# EAGLE board EEZ PSU power board r5B9 (EAGLE 6.1), part 1 of 2
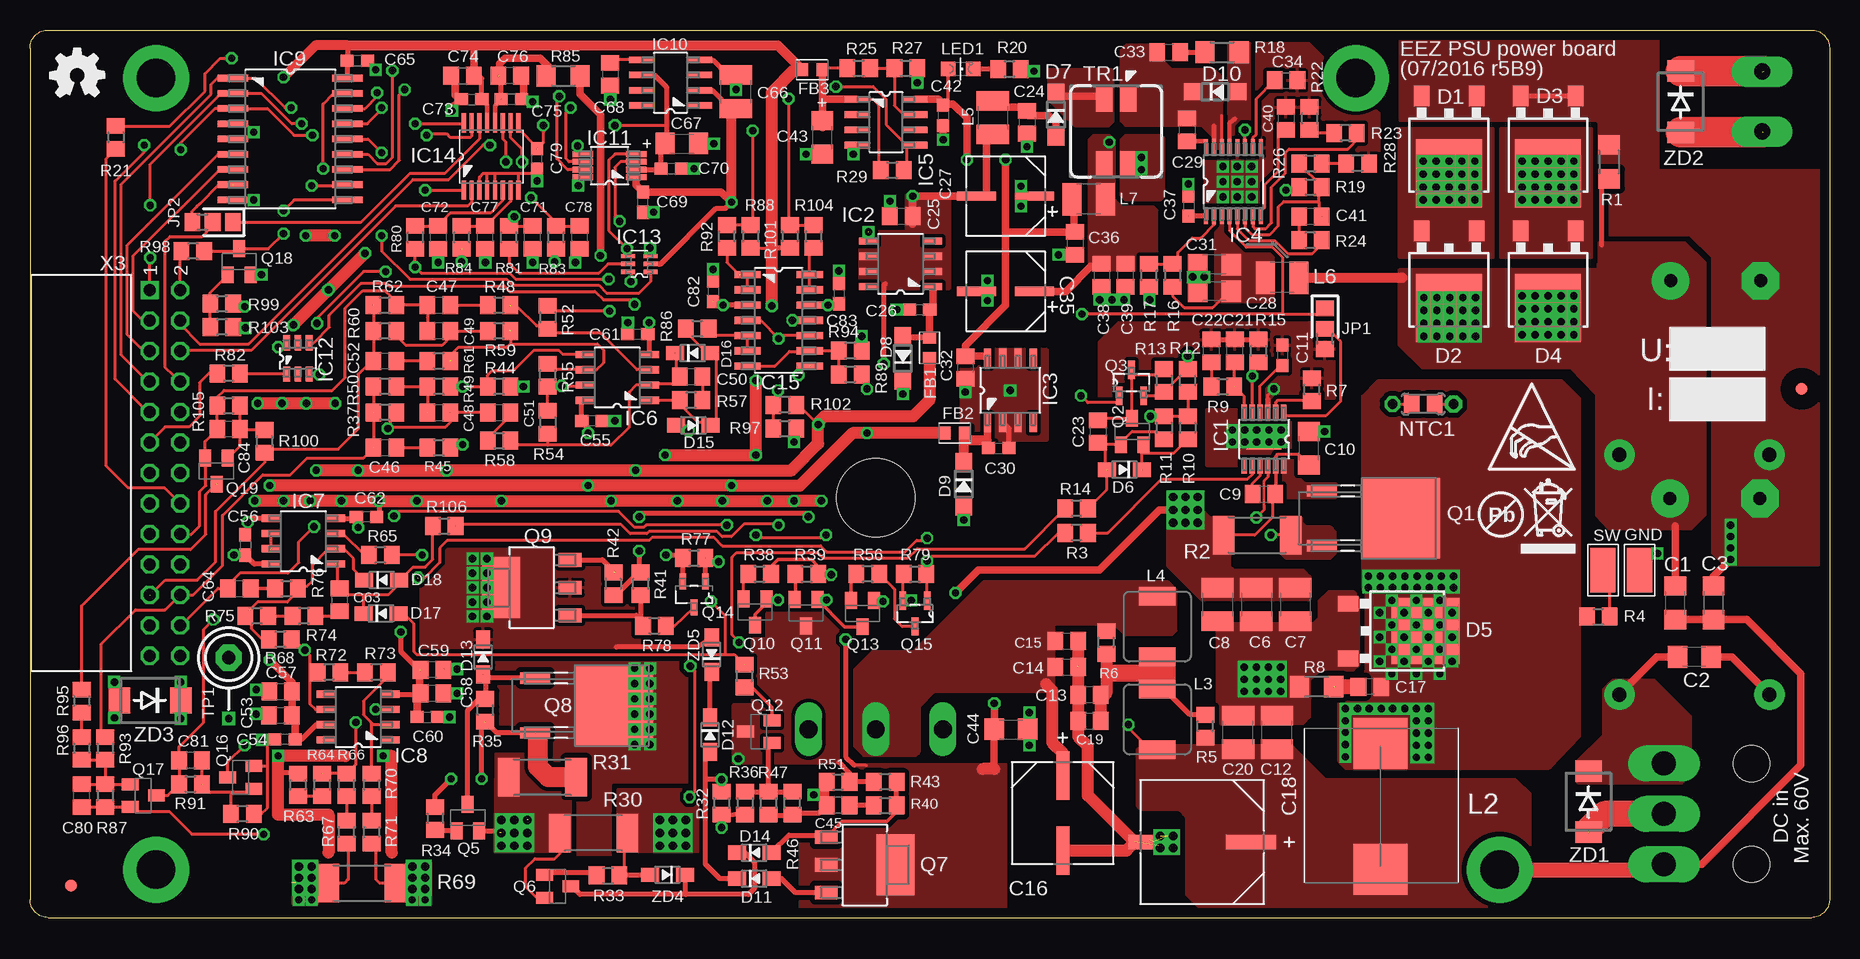
[diagram p5: board, top side]
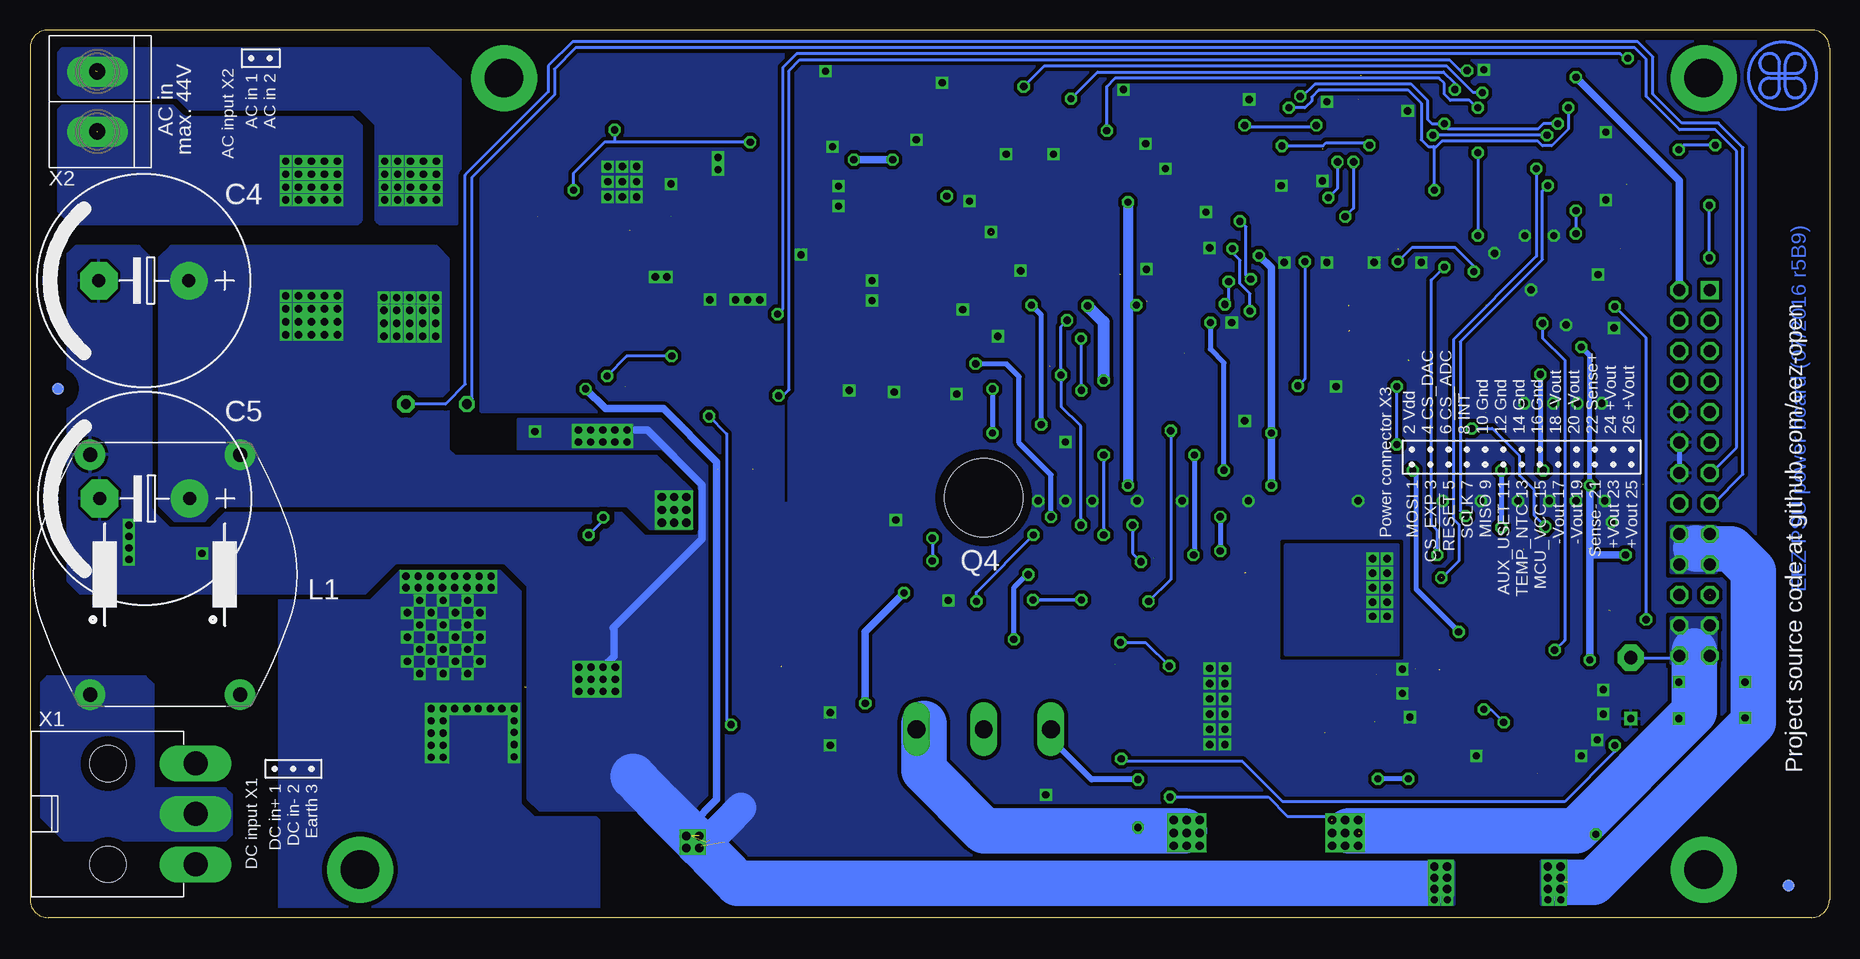
[diagram p6: board, bottom side, seen from below]

Size 150 x 74 mm. Coordinates in mm from the lower left corner, seen from the top.
Outline: 1.5,0 148.5,0 arc90 150,1.5 150,72.5 arc90 148.5,74 1.5,74 arc90 0,72.5 0,1.5 arc90 1.5,0
Copper layers (1+5*16): Top 0.035mm / dielectric 0.75mm / Route5 0.035mm / dielectric 0.75mm / Bottom 0.035mm
Design rules: minimum track width 10mil, minimum drill 0.5mm, track to track 8mil, track to pad 8mil, pad to pad 8mil, via to via 8mil, smd to smd 8mil, copper to edge 30mil, drill to drill 8mil, minimum pad ring 10mil, minimum via ring 8mil, stop-mask expansion 4mil, vias tented up to drill 25mil, thermal gap 10mil
Net classes: 0 default: width 0.254 mm, drill 0.584 mm, clearance 0.254 mm; 1 dgnd: width 0.254 mm, drill 0.584 mm, clearance 0.254 mm; 2 gnd: width 0.254 mm, drill 0.584 mm, clearance 0.254 mm

## Footprints (pad centres in the part's own frame; a part is rotated, then mirrored left to right if it is on the bottom)
C1206 = smd 1.6 x 1.8: 1 -1.4,0; 2 1.4,0
ECAP7.5/18 = drill 1.1 pad 3.14: + -3.75,0 | drill 1.1 pad 3.14 octagon: - 3.75,0
C1210 = smd 1.6 x 2.7: 1 -1.4,0; 2 1.4,0
C0805 = smd 1.3 x 1.5: 1 -0.95,0; 2 0.95,0
C0603 = smd 1.1 x 1: 1 -0.85,0; 2 0.85,0
CAPAE830X1050N = smd 4.064 x 1.092: 1 -3.124,0; 2 3.124,0
PANASONIC_F = smd 4.166 x 1.194: 1 -4.064,0; 2 4.064,0
CAPAE660X610N = smd 3.251 x 0.762: 1 -2.413,0; 2 2.413,0
EC1206 = smd 1.6 x 1.8: + -1.4,0; - 1.4,0
TO252@1 = smd 1.3 x 1.7: 1 -2.285,-5.49; 2 2.285,-5.49 | smd 5.5 x 5.7: 3 0,0.95
TO252 = smd 1.3 x 1.7: 1 -2.285,-5.49; 2 2.285,-5.49 | smd 5.5 x 5.7: 3 0,0.95
SOD323-W = smd 1.5 x 1.2: A 1.45,0; C -1.45,0
SOD123 = smd 1.4 x 1.4: A 1.9,0; C -1.9,0
BEAD0603 = smd 1 x 1.1: P$1 -0.85,0; P$2 0.85,0
FIDUCIAL_DUAL = smd 1.016 x 1.016 bottom: B 0,0 | smd 1.016 x 1.016: T 0,0
S1751-46R = smd 3.7 x 2.1: P$1 0,0
LTC_05-08-1666 = smd 1.27 x 0.457: 1 -2.235,1.63; 2 -2.235,0.98; 3 -2.235,0.33; 4 -2.235,-0.33; 5 -2.235,-0.98; 6 -2.235,-1.63; 7 2.235,-1.63; 8 2.235,-0.98; 9 2.235,-0.33; 10 2.235,0.33; 11 2.235,0.98; 12 2.235,1.63 | smd 1.753 x 2.946: TP 0,0
SOIC127P600X173-8N = smd 1.55 x 0.6: 1 -2.7,1.9; 2 -2.7,0.63; 3 -2.7,-0.64; 4 -2.7,-1.91; 5 2.7,-1.91; 6 2.7,-0.64; 7 2.7,0.63; 8 2.7,1.9
SOP65P640X110-16N = smd 1.422 x 0.356: 1 -2.845,2.286; 2 -2.845,1.626; 3 -2.845,0.965; 4 -2.845,0.33; 5 -2.845,-0.33; 6 -2.845,-0.965; 7 -2.845,-1.626; 8 -2.845,-2.286; 9 2.845,-2.286; 10 2.845,-1.626; 11 2.845,-0.965; 12 2.845,-0.33; 13 2.845,0.33; 14 2.845,0.965; 15 2.845,1.626; 16 2.845,2.286
SOIC127P600X175-8N = smd 1.981 x 0.559: 1 -2.464,1.905; 2 -2.464,0.635; 3 -2.464,-0.635; 4 -2.464,-1.905; 5 2.464,-1.905; 6 2.464,-0.635; 7 2.464,0.635; 8 2.464,1.905
SOIC127P1030X265-18N = smd 2.54 x 0.559: 1 -4.775,5.08; 2 -4.775,3.81; 3 -4.775,2.54; 4 -4.775,1.27; 5 -4.775,0; 6 -4.775,-1.27; 7 -4.775,-2.54; 8 -4.775,-3.81; 9 -4.775,-5.08; 10 4.775,-5.08; 11 4.775,-3.81; 12 4.775,-2.54; 13 4.775,-1.27; 14 4.775,0; 15 4.775,1.27; 16 4.775,2.54; 17 4.775,3.81; 18 4.775,5.08
DGK8-M = smd 1.727 x 0.483: 1 -2.235,0.965; 2 -2.235,0.33; 3 -2.235,-0.33; 4 -2.235,-0.965; 5 2.235,-0.965; 6 2.235,-0.33; 7 2.235,0.33; 8 2.235,0.965
SOT95P280X145-6N = smd 1.27 x 0.559: 1 -1.295,0.94; 2 -1.295,0; 3 -1.295,-0.94; 4 1.295,-0.94; 5 1.295,0; 6 1.295,0.94
SOT65P210X110-6N = smd 1.168 x 0.356: 1 -0.94,0.66; 2 -0.94,0; 3 -0.94,-0.66; 4 0.94,-0.66; 5 0.94,0; 6 0.94,0.66
PW(R-PDSO-G16) = smd 1.6 x 0.35: 1 -2.8,2.3; 2 -2.8,1.65; 3 -2.8,1; 4 -2.8,0.35; 5 -2.8,-0.3; 6 -2.8,-0.95; 7 -2.8,-1.6; 8 -2.8,-2.25; 9 2.8,-2.25; 10 2.8,-1.6; 11 2.8,-0.95; 12 2.8,-0.3; 13 2.8,0.35; 14 2.8,1; 15 2.8,1.65; 16 2.8,2.3
SOIC127P600X175-14N = smd 2.2 x 0.6: 1 -2.591,3.81; 2 -2.591,2.54; 3 -2.591,1.27; 4 -2.591,0; 5 -2.591,-1.27; 6 -2.591,-2.54; 7 -2.591,-3.81; 8 2.591,-3.81; 9 2.591,-2.54; 10 2.591,-1.27; 11 2.591,0; 12 2.591,1.27; 13 2.591,2.54; 14 2.591,3.81
A0R-JMP = smd 1.5 x 1.3: 1 0,1.7; 2 0,0; 3 0,-1.7
RN114 = drill 1.2 pad 2.54: 1 -10,6.25; 2 -10,-6.25; 3 10,-6.25; 4 10,6.25
WE-HCI_1350/1365 = smd 4.25 x 4.5: 1 -5.25,0; 2 5.27,0
IHLP-2020BZ-11 = smd 3.048 x 1.524: 1 0,2.515; 2 0,-2.515
L1210 = smd 1.6 x 2.7: 1 -1.4,0; 2 1.4,0
LED_0805 = smd 1.2 x 1.2: A 0,-1.05; C 0,1.05
R_0204/5+0805 = smd 1.3 x 1.5: 1 -0.95,0; 2 0.95,0 | drill 0.813 octagon: 1.1 -2.54,0 | drill 0.8 pad 1.422 octagon: 2.1 2.54,0
TO229P990X239-3N = smd 0.94 x 2.489: 1 -2.286,-6.401; 3 2.286,-6.401 | smd 6.731 x 6.528: 2 0,0.152
SOT23-BEC = smd 1 x 1.4: B -0.95,-1.1; C 0,1.1; E 0.95,-1.1
SOT103P240X110-3N = smd 1.524 x 0.559: 1 -1.079,1.016; 2 -1.079,-1.016; 3 1.079,0
TO247BH-CLR = drill 1.499 long: D 0,-19.304; G -5.588,-19.304; S 5.588,-19.304 | hole 6.5: 0,0
SOT230P700X180-4N = smd 1.905 x 1.143: 1 -3.2,2.311; 2 -3.2,0; 3 -3.2,-2.311 | smd 3.175 x 5.08: 4 2.565,0
SOT95P237X112-3N = smd 1.321 x 0.559: 1 -1.092,0.94; 2 -1.092,-0.94; 3 1.092,0
R1206 = smd 1.6 x 1.803: 1 -1.422,0; 2 1.422,0
R2512 = smd 1.8 x 3.2: 1 -2.8,0; 2 2.8,0
R0805 = smd 1.3 x 1.5: 1 -0.95,0; 2 0.95,0
SHORT_NOHOLE = smd 0.5 x 0.25 bottom: P$1 0,0.117; P$2 0,-0.117
TP_1.1MM = drill 0.6 square: GND 5.08,0 | drill 1.1 pad 2.184 octagon: TIP 0,0
SRF0703 = smd 1.4 x 2.1: 1 1,2.7; 2 -1,2.7; 3 -1,-2.7; 4 1,-2.7
MINIFIT_6659-3 = drill 2 pad 2.54 long: 1 0,0; 2 0,-4.2; 3 0,-8.4 | hole 3: -7.3,0; -7.3,-8.4
TBLOCK5.0_2 = drill 1.35 pad 2.54 long: 1 0,0; 2 0,-5
SSW-113-02-T-D-RA = drill 1 pad 1.5 square: 1 30.48,2.54 | drill 1 pad 1.5 octagon: 2 30.48,0; 3 27.94,2.54; 4 27.94,0; 5 25.4,2.54; 6 25.4,0; 7 22.86,2.54; 8 22.86,0; 9 20.32,2.54; 10 20.32,0; 11 17.78,2.54; 12 17.78,0; 13 15.24,2.54; 14 15.24,0; 15 12.7,2.54; 16 12.7,0; 17 10.16,2.54; 18 10.16,0; 19 7.62,2.54; 20 7.62,0; 21 5.08,2.54; 22 5.08,0; 23 2.54,2.54; 24 2.54,0; 25 0,2.54; 26 0,0
DO214AA = smd 1.8 x 2.2: A 2.55,0; C -2.55,0

## Placement (x,y rotation side)
C1  100n  [C1206]  137.15,26.23 90 top
C2  100n  [C1206]  138.73,21.73 180 top
C3  100n  [C1206]  140.32,26.23 270 top
C4  2m2  [ECAP7.5/18]  140.51,53.1 180 bottom
C5  2m2  [ECAP7.5/18]  140.45,34.93 180 bottom
C6  4u7  [C1210]  102.22,26.11 270 top
C7  4u7  [C1210]  105.46,26.11 270 top
C8  4u7  [C1210]  98.98,26.11 270 top
C9  470n  [C0805]  102.86,35.32 0 top
C10  1u/100V  [C1206]  106.6,39.13 90 top
C11  100n  [C0603]  104.38,46.87 270 top
C12  10u  [C1210]  103.93,15.44 90 top
C13  1u  [C0805]  88.31,18.55 180 top
C14  n.c.  [C0805]  86.41,20.9 0 top
C15  n.c.  [C0805]  86.41,23.06 0 top
C16  EEEFK1J470P  [CAPAE830X1050N]  86.09,8.71 270 top
C17  330p  [C0805]  111.68,19.25 180 top
C18  EEEFK1J101P  [PANASONIC_F]  97.71,6.3 180 top
C19  n.c.  [C0805]  88.31,16.39 0 top
C20  10u  [C1210]  100.7,15.44 90 top
C21  120p  [C0805]  100.44,47.25 90 top
C22  4n7  [C0805]  98.47,47.25 90 top
C23  470p  [C0805]  89.01,40.52 270 top
C24  2u2  [C0805]  83.11,66.3 270 top
C25  470n  [C0805]  72.63,58.49 0 top
C26  100n  [C0603]  74.15,50.68 0 top
C27  47u  [CAPAE660X610N]  81.33,60.14 180 top
C28  1u/100V  [C1206]  98.73,52.21 180 top
C29  22n  [C0805]  96.44,65.67 270 top
C30  100n  [C0603]  80.76,39.13 0 top
C31  1u/100V  [C1206]  98.73,54.43 180 top
C32  470n  [C0805]  77.96,45.86 270 top
C33  330p  [C0805]  94.92,72.15 0 top
C34  10n  [C0805]  104.7,69.8 0 top
C35  47u  [CAPAE660X610N]  81.33,52.21 180 top
C36  2u2  [C0805]  87.11,56.21 270 top
C37  100n  [C0603]  96.57,59.32 270 top
C38  2u2  [C0805]  89.33,53.54 270 top
C39  n.c.  [C0805]  91.3,53.54 270 top
C40  3n3  [C0805]  104.7,66.62 270 top
C41  1n  [C0805]  106.73,58.43 180 top
C42  100n  [C0603]  76.12,66.88 270 top
C43  4u7  [EC1206]  66.03,65.03 270 top
C44  1u/100V  [C1206]  81.77,15.69 0 top
C45  10n  [C0805]  67.36,9.34 180 top
C46  47p  [C0805]  29.58,39.19 0 top
C47  1n  [C0805]  34.08,51.06 0 top
C48  2n2  [C0805]  34.08,42.11 0 top
C49  2n2  [C0805]  34.08,48.9 180 top
C50  120p  [C0805]  55.1,45.09 0 top
C51  1n  [C0805]  39.1,42.11 0 top
C52  47p  [C0805]  29.58,46.42 0 top
C53  10n  [C0805]  20.88,16.87 0 top
C54  100n  [C0603]  21.26,14.87 180 top
C55  100n  [C0603]  46.85,41.41 180 top
C56  100n  [C0603]  17.96,31.06 270 top
C57  1u  [C0805]  20.89,18.85 0 top
C58  10n  [C0805]  33.51,18.68 180 top
C59  1u  [C0805]  33.51,20.66 180 top
C60  100n  [C0603]  33.13,16.71 0 top
C61  100n  [C0603]  50.66,48.65 0 top
C62  100n  [C0603]  28.05,33.41 180 top
C63  1n  [C0805]  25.83,26.49 90 top
C64  1n  [C0805]  17.45,27.44 0 top
C65  100n  [C0603]  27.29,71.45 0 top
C66  10u  [C1210]  58.85,68.84 90 top
C67  10u  [EC1206]  54.34,64.53 0 top
C68  1u  [C0805]  48.37,70.3 270 top
C69  100n  [C0603]  51.1,59.64 90 top
C70  100n  [C0603]  53.45,62.43 180 top
C71  3n3  [C0805]  41.9,56.72 90 top
C72  3n3  [C0805]  34.02,56.72 270 top
C73  100n  [C0603]  36.81,68.21 0 top
C74  1u  [C0805]  36.05,70.18 0 top
C75  100n  [C0603]  40.12,68.21 180 top
C76  1u  [C0805]  39.99,70.18 180 top
C77  3n3  [C0805]  37.96,56.72 90 top
C78  3n3  [C0805]  45.83,56.72 90 top
C79  100n  [C0603]  42.28,63.26 90 top
C80  10n  [C0805]  4.3,10.17 90 top
C81  2n2  [C0805]  13.38,13.09 180 top
C82  100n  [C0603]  56.94,52.21 270 top
C83  100n  [C0603]  67.42,52.02 270 top
C84  10n  [C0805]  16.56,40.71 180 top
D1  STPS15H100  [TO252@1]  118.29,63 180 top
D2  STPS15H100  [TO252@1]  118.29,51.76 180 top
D3  STPS15H100  [TO252@1]  126.54,63 180 top
D4  STPS15H100  [TO252@1]  126.54,51.76 180 top
D5  STPS15H100  [TO252]  115.36,23.89 270 top
D6  BAS316  [SOD323-W]  91.23,37.35 180 top
D7  DFLS1100-7  [SOD123]  85.52,66.94 270 top
D8  SKL16  [SOD123]  72.76,46.62 90 top
D9  SKL16  [SOD123]  77.84,36.14 270 top
D10  DFLS1100-7  [SOD123]  98.79,68.84 0 top
D11  BAS316  [SOD323-W]  60.37,3.25 0 top
D12  BAS316  [SOD323-W]  56.69,15.25 270 top
D13  BAS316  [SOD323-W]  37.77,21.73 270 top
D14  BAS316  [SOD323-W]  60.37,5.41 0 top
D15  BAS316  [SOD323-W]  55.29,41.03 180 top
D16  BAS316  [SOD323-W]  55.23,47.06 0 top
D17  BAS316  [SOD323-W]  29.26,25.35 0 top
D18  BAS316  [SOD323-W]  29.32,28.14 0 top
EEZ_SIGNATURE  SIGNATURESMALL  [SIGNATURE_5MM]  3.92,70.19 180 top
FB1  60R@100MHz  [BEAD0603]  74.98,47.51 270 top
FB2  60R@100MHz  [BEAD0603]  77.07,40.4 180 top
FB3  60R@100MHz  [BEAD0603]  65.2,70.69 180 top
FM1  FIDUCIAL_2  [FIDUCIAL_DUAL]  147.69,44.08 0 top
FM2  FIDUCIAL_2  [FIDUCIAL_DUAL]  3.41,2.68 0 top
GND  S1751-46R  [S1751-46R]  134.16,28.97 90 top
IC1  LTC3864EMSE#PBF  [LTC_05-08-1666]  102.86,39.89 270 top
IC2  MC79L05  [SOIC127P600X173-8N]  72.57,54.49 180 top
IC3  MC78L05  [SOIC127P600X173-8N]  81.71,43.95 90 top
IC4  LM5574MTX/NOPB  [SOP65P640X110-16N]  100.31,61.35 90 top
IC5  LP2951SO8  [SOIC127P600X175-8N]  71.36,66.3 0 top
IC6  TL072D  [SOIC127P600X173-8N]  48.94,45.03 180 top
IC7  TL072D  [SOIC127P600X173-8N]  22.78,31.38 180 top
IC8  OP27GSZ  [SOIC127P600X173-8N]  27.35,16.71 180 top
IC9  MCP23S08-E/SO  [SOIC127P1030X265-18N]  21.7,64.91 0 top
IC10  REF5025AIDG4  [SOIC127P600X175-8N]  53.39,69.61 180 top
IC11  DAC8552IDGKTG4  [DGK8-M]  48.31,62.68 180 top
IC12  ADG465SOT-23  [SOT95P280X145-6N]  22.34,46.62 90 top
IC13  TS5A9411DCKT  [SOT65P210X110-6N]  50.78,54.49 180 top
IC14  ADS1120IPWR  [PW(R-PDSO-G16)]  38.47,63.45 90 top
IC15  LP339D  [SOIC127P600X175-14N]  62.41,49.79 0 top
JP1  0R-JUMPA  [A0R-JMP]  107.94,49.09 180 top
JP2  0R-JUMPA  [A0R-JMP]  15.23,57.99 90 top
L1  RN114-4/02  [RN114]  138.73,28.58 90 bottom
L2  7443551331  [WE-HCI_1350/1365]  112.57,9.28 270 top
L3  IHLP2020CZER3R3M11  [IHLP-2020BZ-11]  93.97,16.52 180 top
L4  IHLP2020CZER3R3M11  [IHLP-2020BZ-11]  93.97,24.27 180 top
L5  2u2  [L1210]  80.25,66.68 270 top
L6  2u2  [L1210]  104.38,53.35 180 top
L7  2u2  [L1210]  88.25,59.89 180 top
LED1  HSMY-C170  [LED_0805]  77.58,70.75 270 top
NTC1  10K/Beta:3570K  [R_0204/5+0805]  116.13,42.81 0 top
Q1  SUD19P06-60  [TO229P990X239-3N]  114.09,33.28 270 top
Q2  MMBT5401  [SOT23-BEC]  91.87,40.52 0 top
Q3  2N7002  [SOT103P240X110-3N]  91.81,44.59 90 top
Q4  IRFP250N  [TO247BH-CLR]  70.5,35 0 top
Q5  BC857C  [SOT23-BEC]  36.5,8.33 0 top
Q6  BC846C  [SOT23-BEC]  43.99,2.61 270 top
Q7  BCP56-16.115  [SOT230P700X180-4N]  69.58,4.39 0 top
Q8  IRFR5410  [TO229P990X239-3N]  48.5,17.68 270 top
Q9  BCP56-16.115  [SOT230P700X180-4N]  41.83,27.5 180 top
Q10  MMBT5401  [SOT23-BEC]  60.44,25.47 180 top
Q11  MMBT5401  [SOT23-BEC]  64.69,25.41 180 top
Q12  MMBT5551  [SOT23-BEC]  60.75,15.5 90 top
Q13  MMBT5551  [SOT23-BEC]  69.39,25.35 180 top
Q14  BSS84P  [SOT95P237X112-3N]  55.36,26.93 270 top
Q15  2N7002  [SOT103P240X110-3N]  73.77,25.35 270 top
Q16  MMBT5551  [SOT23-BEC]  17.57,11.69 90 top
Q17  MMBT5401  [SOT23-BEC]  9.45,10.17 270 top
Q18  MMBT5551  [SOT23-BEC]  17.45,54.68 0 top
Q19  MMBT5551  [SOT23-BEC]  15.54,37.22 180 top
R1  12K  [R1206]  131.62,63 90 top
R2  R010/2W  [R2512]  102.28,31.89 0 top
R3  0R  [R0805]  87.23,32.08 180 top
R4  1K  [R0805]  130.73,25.09 0 top
R5  100R  [R0805]  97.97,15.95 90 top
R6  100R  [R0805]  89.71,22.93 90 top
R7  47K  [R0805]  106.86,44.02 90 top
R8  10R  [R1206]  107.24,19.25 0 top
R9  10K  [R0805]  99.43,44.27 0 top
R10  10K  [R0805]  96.5,40.84 270 top
R11  100K  [R0805]  94.54,40.84 270 top
R12  330K  [R0805]  96.5,44.78 90 top
R13  n.c.  [R0805]  94.54,44.78 270 top
R14  100K  [R0805]  87.23,34.11 180 top
R15  4K7  [R0805]  102.41,47.25 90 top
R16  47K  [R0805]  95.23,53.54 270 top
R17  2K2  [R0805]  93.27,53.54 90 top
R18  10R  [R1206]  99.36,72.15 180 top
R19  47K  [R0805]  106.73,60.91 0 top
R20  470R  [R0805]  81.65,70.75 0 top
R21  0R  [R0805]  7.16,65.03 270 top
R22  10K  [R0805]  106.67,66.62 90 top
R23  10K  [R0805]  109.65,65.41 180 top
R24  51K  [R0805]  106.73,56.46 180 top
R25  16K  [R0805]  69.07,70.81 0 top
R26  5K6  [R0805]  106.73,62.87 0 top
R27  5K1  [R0805]  73.01,70.81 0 top
R28  1K8  [R0805]  110.67,62.87 180 top
R29  10K  [R0805]  71.87,62.3 0 top
R30  R080/3W  [R2512]  46.98,7.06 180 top
R31  2R2/2W  [R2512]  42.72,11.69 180 top
R32  2K2  [R0805]  57.64,9.53 270 top
R33  1K  [R0805]  48.18,3.5 0 top
R34  2K2  [R0805]  33.77,8.26 270 top
R35  2K2  [R0805]  37.96,17.28 90 top
R36  16K  [R0805]  59.61,9.53 270 top
R37  2K2  [R0805]  29.58,42.11 180 top
R38  220R  [R0805]  60.82,28.65 0 top
R39  220R  [R0805]  64.75,28.65 0 top
R40  470R  [R0805]  71.3,9.34 0 top
R41  1K  [R0805]  50.91,27.82 90 top
R42  220R  [R0805]  48.63,27.82 270 top
R43  100R  [R0805]  71.3,11.31 180 top
R44  7K5 0.1%  [R0805]  39.1,44.27 180 top
R45  10K  [R0805]  34.08,39.19 0 top
R46  2K2  [R0805]  63.55,9.53 90 top
R47  750R  [R0805]  61.58,9.53 90 top
R48  220R  [R0805]  39.1,51.06 0 top
R49  100K 0.1%  [R0805]  34.08,44.27 180 top
R50  20K 0.1%  [R0805]  29.58,44.27 180 top
R51  51K  [R0805]  67.36,11.31 0 top
R52  10K  [R0805]  43.16,50.05 270 top
R53  470R  [R0805]  59.55,20.14 270 top
R54  10K  [R0805]  43.16,41.3 270 top
R55  7K5 0.1%  [R0805]  43.16,45.22 90 top
R56  1K8  [R0805]  69.83,28.65 180 top
R57  0R  [R0805]  55.1,43.13 180 top
R58  220R  [R0805]  39.1,39.76 0 top
R59  100K 0.1%  [R0805]  39.1,48.9 180 top
R60  20K 0.1%  [R0805]  29.58,48.9 180 top
R61  10K  [R0805]  34.08,46.42 0 top
R62  2K2  [R0805]  29.58,51.06 0 top
R63  180R 0.1%  [R0805]  22.34,11.06 270 top
R64  2K37 0.1%  [R0805]  24.37,11.06 90 top
R65  2K2  [R0805]  29.21,30.22 180 top
R66  51R 0.1%  [R0805]  26.4,11.06 90 top
R67  51R 0.1%  [R0805]  26.4,7.12 90 top
R68  2K2  [R0805]  20.87,23.19 180 top
R69  R020/2W  [R2512]  27.67,2.87 0 top
R70  51R 0.1%  [R0805]  28.5,11.06 90 top
R71  51R 0.1%  [R0805]  28.5,7.12 90 top
R72  2K37 0.1%  [R0805]  24.94,20.46 180 top
R73  180R 0.1%  [R0805]  28.88,20.46 180 top
R74  1K  [R0805]  22.84,25.16 180 top
R75  10K  [R0805]  18.91,25.16 180 top
R76  10K  [R0805]  21.38,27.44 0 top
R77  100K  [R0805]  55.36,29.98 0 top
R78  10K  [R0805]  52.05,24.33 0 top
R79  100K  [R0805]  73.77,28.65 0 top
R80  220R  [R0805]  32.12,56.72 90 top
R81  220R  [R0805]  39.93,56.72 90 top
R82  1K  [R0805]  16.56,45.35 180 top
R83  220R  [R0805]  43.86,56.72 90 top
R84  220R  [R0805]  35.99,56.72 90 top
R85  10R  [R1206]  44.44,70.18 180 top
R86  10K  [R0805]  55.61,49.09 0 top
R87  330R  [R0805]  6.27,10.17 270 top
R88  5K1  [R0805]  60.06,56.78 270 top
R89  47K  [R0805]  68.37,45.28 0 top
R90  47K  [R0805]  17.7,8.65 180 top
R91  47K  [R0805]  13.38,11.12 0 top
R92  5K6  [R0805]  58.09,56.78 90 top
R93  750R  [R0805]  6.27,14.11 270 top
R94  2K2  [R0805]  68.37,47.25 180 top
R95  1K  [R0805]  4.3,18.04 270 top
R96  2K2  [R0805]  4.3,14.11 270 top
R97  5K6  [R0805]  62.91,40.78 0 top
R98  10K  [R0805]  13.57,55.57 180 top
R99  10K  [R0805]  15.99,51.19 0 top
R100  750R  [R0805]  19.54,39.7 270 top
R101  5K1  [R0805]  63.36,56.78 270 top
R102  4K7  [R0805]  62.91,42.75 180 top
R103  47K  [R0805]  15.99,49.22 180 top
R104  5K6  [R0805]  65.33,56.78 90 top
R105  330R  [R0805]  16.56,42.68 0 top
R106  10K  [R0805]  34.53,32.65 0 top
SH1  Pgnd to Pout- short  [SHORT_NOHOLE]  94.85,6.93 180 top
SH2  Sgnd to Pgnd short  [SHORT_NOHOLE]  94.79,6.74 270 top
SW  S1751-46R  [S1751-46R]  131.11,28.97 90 top
TP1  [TP_1.1MM]  16.56,21.66 270 top
TR1  SRF0703-821M  [SRF0703]  90.54,65.54 0 top
U$2  [RECYCLE_BIN1/8]  124.26,30.36 0 top
U$3  [PB_SMALL]  122.61,33.6 0 top
U$4  [ESD_SYMBOL]  121.62,37.39 0 top
X1  39303035  [MINIFIT_6659-3]  136.19,12.84 0 bottom
X2  282836-2  [TBLOCK5.0_2]  144.38,65.54 180 bottom
X3  SSW-113-02-T-D-RA  [SSW-113-02-T-D-RA]  12.51,21.83 90 top
ZD1  n.c.  [DO214AA]  129.91,9.66 270 top
ZD2  n.c.  [DO214AA]  137.59,68.02 270 top
ZD3  See Note 3.2  [DO214AA]  10.02,18.11 180 top
ZD4  BZX384-C15.115  [SOD323-W]  53.13,3.57 180 top
ZD5  PDZ6.2B  [SOD323-W]  56.82,21.92 90 top